# EasyEDA Pro project Twinverter_PB_MTE_3.eprj, board Twinverter_PB_MTE
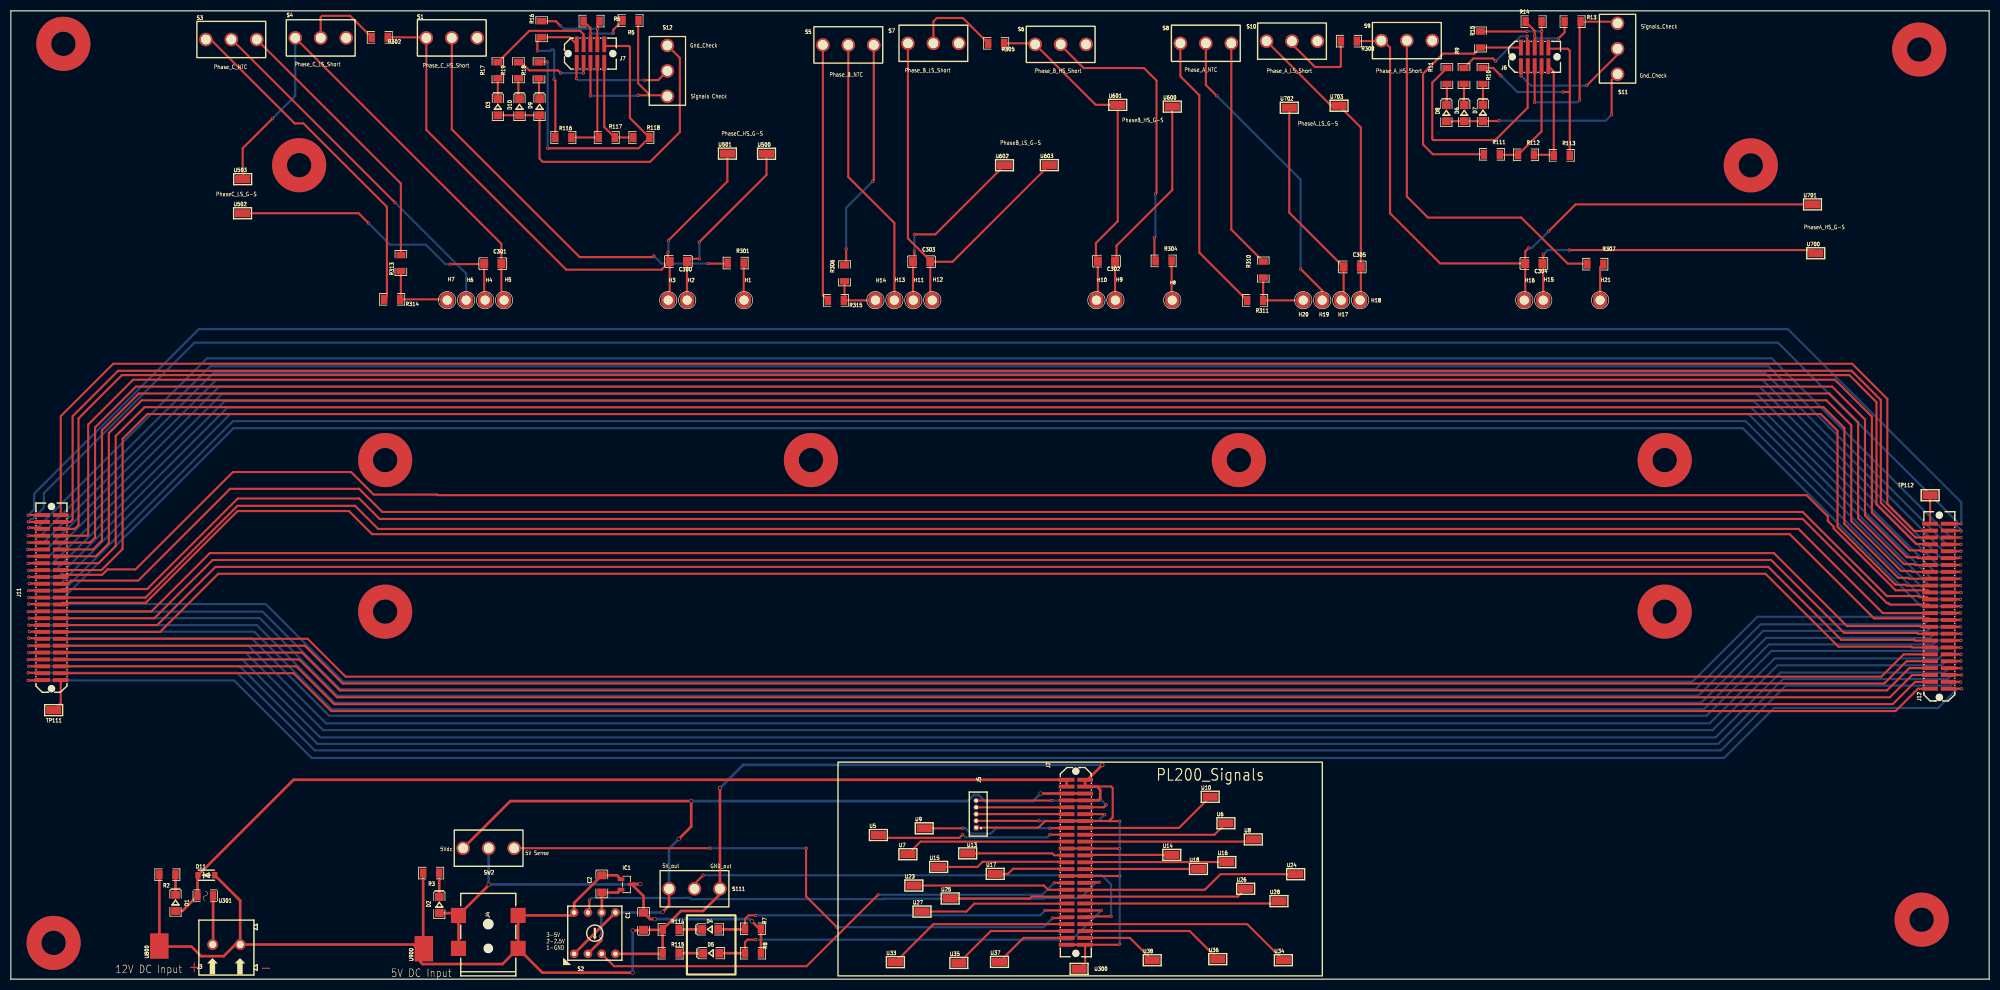
[diagram p4: board, top side]
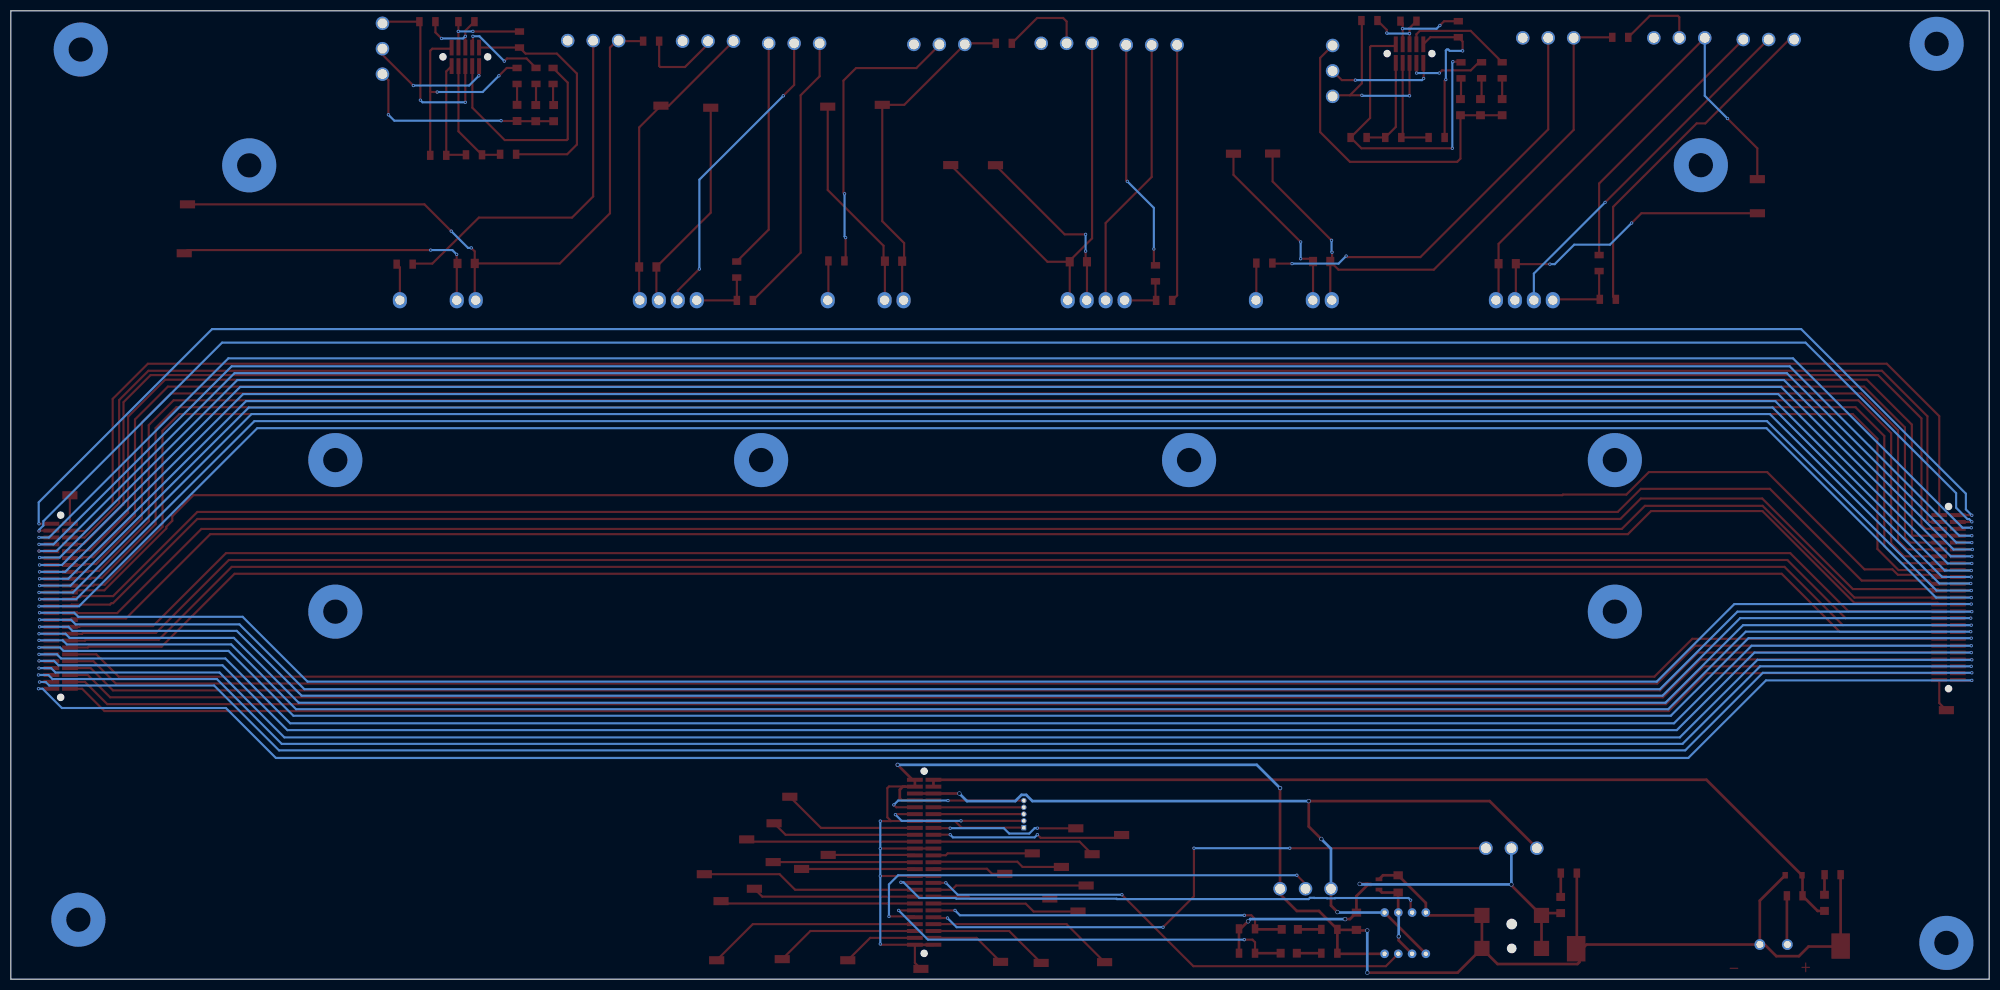
[diagram p5: board, bottom side, seen from below]

Outline 365.2 x 178.9 mm; copper layers: Top Layer, Bottom Layer. Coordinates in mm from the lower left corner of the outline.
Outline path: 0,178.9 365.2,178.9 365.2,0 0,0 0,178.9
Stack: Top Layer 0.0009mm / dielectric 1 0.0384mm FR4 er 4.5 / Bottom Layer 0.0009mm

## Design rules (mm)
template: 用户自定义配置
spacing safeClearance (default): track to track 0.3, other pairs 0 to 0.5
track width trackWidth (default): min 0.127, default 0.254, max 2.54
differential pair differentialPair (default): width min 0.127, default 0.254, max 2.54; gap min 0.152, default 0.152
via viaSize (default): diameter min 0.5, default 0.61, max 10; hole min 0.3, default 0.305, max 6

## Placement (name value [footprint] x y rotation side)
C1  1uF  [C1206]  116.8 10.7 270 top
C2  1uF  [C1206]  109.1 17.6 90 top
C300  100nF  [C1206]  123.22 132.58 180 top
C301  100nF  [C1206]  88.97 132.18 0 top
C302  100nF  [C1206]  202.25 132.65 180 top
C303  100nF  [C1206]  168.13 132.54 0 top
C304  100nF  [C1206]  281.16 132.23 180 top
C305  100nF  [C1206]  247.62 131.58 0 top
D1  XL-3216SURC  [LED1206-R-RD_RED]  30.4 14.1 270 top
D2  XL-3216SURC  [LED1206-R-RD_RED]  79.1 13.7 270 top
D3  XL-3216SURC  [LED1206-R-RD_RED]  89.9 161.1 270 top
D4  XL-3216SURC  [LED1206-R-RD_RED]  129.1 9.2 0 top
D5  XL-3216SURC  [LED1206-R-RD_RED]  129.3 4.8 0 top
D6  XL-3216SURC  [LED1206-R-RD_RED]  268.3 160 270 top
D7  XL-3216SURC  [LED1206-R-RD_RED]  271.75 160.04 270 top
D8  XL-3216SURC  [LED1206-R-RD_RED]  265 160 270 top
D9  XL-3216SURC  [LED1206-R-RD_RED]  97.6 161.1 270 top
D10  XL-3216SURC  [LED1206-R-RD_RED]  93.9 161.1 270 top
D11  PSBD1DF20V3H  [SOD-123F_L2.8-W1.8-LS3.7-RD]  36.1 19.2 0 top
H1  -  [TestPoint:TestPoint_THTPad_D4.0mm_Drill2.0mm]  135.35 125.44 180 top
H2  -  [TestPoint:TestPoint_THTPad_D4.0mm_Drill2.0mm]  124.85 125.44 180 top
H3  -  [TestPoint:TestPoint_THTPad_D4.0mm_Drill2.0mm]  121.35 125.44 180 top
H4  -  [TestPoint:TestPoint_THTPad_D4.0mm_Drill2.0mm]  87.55 125.44 180 top
H5  -  [TestPoint:TestPoint_THTPad_D4.0mm_Drill2.0mm]  91.05 125.44 180 top
H6  -  [TestPoint:TestPoint_THTPad_D4.0mm_Drill2.0mm]  84.05 125.44 180 top
H7  -  [TestPoint:TestPoint_THTPad_D4.0mm_Drill2.0mm]  80.55 125.44 180 top
H8  -  [TestPoint:TestPoint_THTPad_D4.0mm_Drill2.0mm]  214.4 125.44 180 top
H9  -  [TestPoint:TestPoint_THTPad_D4.0mm_Drill2.0mm]  203.9 125.44 180 top
H10  -  [TestPoint:TestPoint_THTPad_D4.0mm_Drill2.0mm]  200.4 125.44 180 top
H11  -  [TestPoint:TestPoint_THTPad_D4.0mm_Drill2.0mm]  166.6 125.44 180 top
H12  -  [TestPoint:TestPoint_THTPad_D4.0mm_Drill2.0mm]  170.1 125.44 180 top
H13  -  [TestPoint:TestPoint_THTPad_D4.0mm_Drill2.0mm]  163.1 125.44 180 top
H14  -  [TestPoint:TestPoint_THTPad_D4.0mm_Drill2.0mm]  159.6 125.44 180 top
H15  -  [TestPoint:TestPoint_THTPad_D4.0mm_Drill2.0mm]  282.88 125.44 180 top
H16  -  [TestPoint:TestPoint_THTPad_D4.0mm_Drill2.0mm]  279.38 125.44 180 top
H17  -  [TestPoint:TestPoint_THTPad_D4.0mm_Drill2.0mm]  245.58 125.44 180 top
H18  -  [TestPoint:TestPoint_THTPad_D4.0mm_Drill2.0mm]  249.08 125.44 180 top
H19  -  [TestPoint:TestPoint_THTPad_D4.0mm_Drill2.0mm]  242.08 125.44 180 top
H20  -  [TestPoint:TestPoint_THTPad_D4.0mm_Drill2.0mm]  238.58 125.44 180 top
H21  -  [TestPoint:TestPoint_THTPad_D4.0mm_Drill2.0mm]  293.38 125.44 180 top
IC1  MCP1700T-2502E/TT(MS)  [SOT-23-3_L2.9-W1.3-P1.90-LS2.4-BR]  113.64 17.5 180 top
J2  TFML-125-02-S-D-A  [CONN-SMD_50P-TFML-125-02-S-D-A]  196.6 21.6 270 top
J3  WJ500V-5.08-2P  [CONN-TH_2P-P5.00_WJ500V-5.08-2P]  39.8 6.4 180 top
J4  DC-005-5A-2.0-SMT  [DC-IN-TH_DC-005-5A-2.0-SMT]  88.14 8.73 90 top
J5  WAFER-MX1.25-5PZZ  [CONN-TH_5P-P1.25_XUNPU_WAFER-MX1.25-5PZZ]  178.2 30.5 90 top
J6  TFML-105-02-S-D-A  [CONN-SMD_TFML-105-02-S-D-A]  281.3 170.4 0 top
J7  TFML-105-02-S-D-A  [CONN-SMD_TFML-105-02-S-D-A]  107 171 0 top
J11  TFML-125-02-S-D-A  [CONN-SMD_50P-TFML-125-02-S-D-A]  7.5 70.5 90 top
J12  TFML-125-02-S-D-A  [CONN-SMD_50P-TFML-125-02-S-D-A]  356 68.9 90 top
R2  1kΩ  [R1206]  28.9 19.3 180 top
R3  300Ω  [R1206]  77.6 19.6 180 top
R5  1kΩ  [R1206]  114.4 177.1 180 top
R6  1kΩ  [R1206]  107.2 177 0 top
R7  10kΩ  [R1206]  137 9.3 0 top
R8  10kΩ  [R1206]  137 4.8 0 top
R9  300Ω  [R1206]  268.25 166.88 270 top
R10  300Ω  [R1206]  271.75 166.86 270 top
R11  300Ω  [R1206]  265.1 166.86 270 top
R13  1kΩ  [R1206]  288.3 176.9 180 top
R14  1kΩ  [R1206]  281.1 176.9 0 top
R15  1kΩ  [R1206]  271.3 173.6 270 top
R16  1kΩ  [R1206]  98 175.5 270 top
R17  300Ω  [R1206]  89.9 167.91 270 top
R18  300Ω  [R1206]  97.5 167.9 270 top
R19  300Ω  [R1206]  93.7 167.91 270 top
R111  1kΩ  [R1206]  273.4 152.4 0 top
R112  1kΩ  [R1206]  279.7 152.3 0 top
R113  1kΩ  [R1206]  286.3 152.2 0 top
R114  10kΩ  [R1206]  121.8 9.2 0 top
R115  10kΩ  [R1206]  121.8 4.8 0 top
R116  1kΩ  [R1206]  102 155.5 0 top
R117  1kΩ  [R1206]  110 155.5 0 top
R118  1kΩ  [R1206]  116.4 155.5 0 top
R301  1kΩ  [R1206]  133.8 132.3 0 top
R302  1kΩ  [R1206]  68.1 174 0 top
R304  1kΩ  [R1206]  212.8 132.7 0 top
R305  1kΩ  [R1206]  181.9 172.9 0 top
R306  5.6kΩ  [R1206]  153.9 130.4 90 top
R307  1kΩ  [R1206]  292.5 132.1 0 top
R308  1kΩ  [R1206]  247 173.3 0 top
R310  5.6kΩ  [R1206]  231.2 131.1 90 top
R311  499Ω  [R1206]  229.7 125.4 180 top
R313  5.1kΩ  [R1206]  72 132.3 90 top
R314  499Ω  [R1206]  70.4 125.6 180 top
R315  499Ω  [R1206]  152.3 125.4 180 top
S1  -  [SW-TH_SS-12D10L5]  81.4 173.9 0 top
S2  SS-10-23NP-E  [SW-TH_8P-L10.0-W10.0-P2.54-S7.6-TR_SS-10-23NP-E]  107.8 8.5 180 top
S3  -  [SW-TH_SS-12D10L5]  40.7 173.6 0 top
S4  -  [SW-TH_SS-12D10L5]  57.2 173.9 0 top
S5  -  [SW-TH_SS-12D10L5]  154.6 172.6 0 top
S6  -  [SW-TH_SS-12D10L5]  193.8 172.7 0 top
S7  -  [SW-TH_SS-12D10L5]  170.3 172.9 0 top
S8  -  [SW-TH_SS-12D10L5]  220.6 172.9 0 top
S9  -  [SW-TH_SS-12D10L5]  257.7 173.4 0 top
S10  -  [SW-TH_SS-12D10L5]  236.5 173.3 0 top
S11  -  [SW-TH_SS-12D10L5]  296.6 171.9 270 top
S12  -  [SW-TH_SS-12D10L5]  121.2 167.8 90 top
S111  SS-12D10L5  [SW-TH_SS-12D10L5]  126.2 16.7 180 top
SW2  SS-12D10L5  [SW-TH_SS-12D10L5]  88.2 24.2 180 top
TP111  RH-5015  [SMD_RH-5015]  7.9 49.7 0 top
TP112  RH-5015  [SMD_RH-5015]  354.3 89.4 0 top
U5  RH-5015  [SMD_RH-5015]  160.15 26.63 0 top
U6  RH-5015  [SMD_RH-5015]  224.3 28.8 0 top
U7  RH-5015  [SMD_RH-5015]  165.6 23.09 0 top
U8  RH-5015  [SMD_RH-5015]  229.36 25.82 0 top
U9  RH-5015  [SMD_RH-5015]  168.61 27.87 0 top
U10  RH-5015  [SMD_RH-5015]  221.4 33.7 0 top
U13  RH-5015  [SMD_RH-5015]  176.64 23.25 0 top
U14  RH-5015  [SMD_RH-5015]  214.32 22.96 0 top
U15  RH-5015  [SMD_RH-5015]  171.27 20.73 0 top
U16  RH-5015  [SMD_RH-5015]  224.47 21.63 0 top
U17  RH-5015  [SMD_RH-5015]  181.71 19.46 0 top
U18  RH-5015  [SMD_RH-5015]  219.23 20.36 0 top
U23  RH-5015  [SMD_RH-5015]  166.7 17.3 0 top
U24  RH-5015  [SMD_RH-5015]  237.18 19.39 0 top
U25  RH-5015  [SMD_RH-5015]  173.4 14.91 0 top
U26  RH-5015  [SMD_RH-5015]  227.94 16.71 0 top
U27  RH-5015  [SMD_RH-5015]  168.2 12.5 0 top
U28  RH-5015  [SMD_RH-5015]  234.1 14.42 0 top
U33  RH-5015  [SMD_RH-5015]  163.29 3.15 0 top
U34  RH-5015  [SMD_RH-5015]  234.9 3.5 0 top
U35  RH-5015  [SMD_RH-5015]  175 3 0 top
U36  RH-5015  [SMD_RH-5015]  222.8 3.7 0 top
U37  RH-5015  [SMD_RH-5015]  182.5 3.2 0 top
U38  RH-5015  [SMD_RH-5015]  210.7 3.5 0 top
U300  RH-5015  [SMD_RH-5015]  197.2 1.9 0 top
U301  TLC-NSMD100/24  [F1206]  35.9 15.4 180 top
U500  RH-5015  [SMD_RH-5015]  139.5 152.5 0 top
U501  RH-5015  [SMD_RH-5015]  132.28 152.53 0 top
U502  RH-5015  [SMD_RH-5015]  42.78 141.5 0 top
U503  RH-5015  [SMD_RH-5015]  42.8 147.8 0 top
U600  RH-5015  [SMD_RH-5015]  214.4 161.2 0 top
U601  RH-5015  [SMD_RH-5015]  204.33 161.53 0 top
U602  RH-5015  [SMD_RH-5015]  183.43 150.38 0 top
U603  RH-5015  [SMD_RH-5015]  191.7 150.4 0 top
U700  RH-5015  [SMD_RH-5015]  333.19 134.12 0 top
U701  RH-5015  [SMD_RH-5015]  332.59 143.15 0 top
U702  RH-5015  [SMD_RH-5015]  236 161 0 top
U703  RH-5015  [SMD_RH-5015]  245.19 161.38 0 top
U800  5016  [TEST-SMD_L4.7-P3.4]  27.42 6.12 90 top
U900  5016  [TEST-SMD_L4.7-P3.4]  76.23 5.62 90 top

## Footprints (pads in the part's own frame, mm; a bottom-side part is the same pattern mirrored in y, then rotated)
C1206
  rect 1.485x1.728 smd: 1(-1.593,0) 2(1.593,0)
CONN-SMD_50P-TFML-125-02-S-D-A
  rect 0.74x2.92 smd: 01(-15.24,-1.715) 02(-15.24,1.715) 03(-13.97,-1.715) 04(-13.97,1.715) 05(-12.7,-1.715) 06(-12.7,1.715) 07(-11.43,-1.715) 08(-11.43,1.715) 09(-10.16,-1.715) 10(-10.16,1.715) 11(-8.89,-1.715) 12(-8.89,1.715) 13(-7.62,-1.715) 14(-7.62,1.715) 15(-6.35,-1.715) 16(-6.35,1.715) 17(-5.08,-1.715) 18(-5.08,1.715) 19(-3.81,-1.715) 20(-3.81,1.715) 21(-2.54,-1.715) 22(-2.54,1.715) 23(-1.27,-1.715) 24(-1.27,1.715) 25(0,-1.715) 26(0,1.715) 27(1.27,-1.715) 28(1.27,1.715) 29(2.54,-1.715) 30(2.54,1.715) 31(3.81,-1.715) 32(3.81,1.715) 33(5.08,-1.715) 34(5.08,1.715) 35(6.35,-1.715) 36(6.35,1.715) 37(7.62,-1.715) 38(7.62,1.715) 39(8.89,-1.715) 40(8.89,1.715) 41(10.16,-1.715) 42(10.16,1.715) 43(11.43,-1.715) 44(11.43,1.715) 45(12.7,-1.715) 46(12.7,1.715) 47(13.97,-1.715) 48(13.97,1.715) 49(15.24,-1.715) 50(15.24,1.715)
CONN-SMD_TFML-105-02-S-D-A
  rect 0.74x2.92 smd: 1(-2.54,-1.715) 2(-2.54,1.715) 3(-1.27,-1.715) 4(-1.27,1.715) 5(0,-1.715) 6(0,1.715) 7(1.27,-1.715) 8(1.27,1.715) 9(2.54,-1.715) 10(2.54,1.715)
CONN-TH_2P-P5.00_WJ500V-5.08-2P
  round 2 hole 1.3: 1(-2.54,0) 2(2.54,0)
CONN-TH_5P-P1.25_XUNPU_WAFER-MX1.25-5PZZ
  rect 1x0.9 hole 0.65: 1(-2.5,0)
  round 1 hole 0.65: 2(-1.25,0) 3(-0.001,0) 4(1.25,0) 5(2.5,0)
DC-IN-TH_DC-005-5A-2.0-SMT
  rect 2.8x2.8 smd: 1(-3.05,5.5) 1(3.05,5.5) 2(-3.05,-5.5) 3(3.05,-5.5)
F1206
  rect 1.19x1.728 smd: 1(-1.445,0) 2(1.445,0)
LED1206-R-RD_RED
  rect 1.485x1.62 smd: 1(1.492,0) 2(-1.492,0)
R1206
  rect 1.208x1.701 smd: 1(-1.479,0) 2(1.479,0)
SMD_RH-5015
  rect 2.8x1.5 smd: 1(0,0)
SOD-123F_L2.8-W1.8-LS3.7-RD
  rect 1x1.2 smd: 1(-1.55,0) 2(1.55,0)
SOT-23-3_L2.9-W1.3-P1.90-LS2.4-BR
  rect 1.25x0.7 smd: 1(1,-0.95) 2(1,0.95) 3(-1,0)
SW-TH_8P-L10.0-W10.0-P2.54-S7.6-TR_SS-10-23NP-E
  round 1.6 hole 0.8: 1(3.81,-3.81) 2(-1.27,-3.81) 3(-3.81,-3.81) 11(-3.81,3.81) 12(1.27,3.81) 13(3.81,3.81) C(1.27,-3.81) C1(-1.27,3.81)
SW-TH_SS-12D10L5
  round 2.499 hole 1.801: 1(-4.699,0) 2(0,0) 3(4.699,0)
TEST-SMD_L4.7-P3.4
  rect 4.699x3.429 smd: 1(0,0)
TestPoint:TestPoint_THTPad_D4.0mm_Drill2.0mm
  oval 2.6x3 hole 1.7: 1(0,0)

## Nets
+2.5V: C2.1 IC1.2 S2.2 S2.12
$1I1\$1N11: R311.2 S8.1
$1I1\$1N19: R314.2 S3.1
$1I1\$1N41: R315.2 S5.1
$1I1\$1N11343: R306.2 S5.3
$1I1\$1N11438: R304.1 S6.2
$1I1\$1N11475: R305.1 S7.2
$1I1\$1N11625: R301.1 S1.2
$1I1\$1N11639: R302.1 S4.2
$1I1\$1N11730: R313.2 S3.3
$1I1\$1N12052: R310.2 S8.3
$1I1\$1N12111: R307.1 S9.2
$1I1\$1N12143: R308.1 S10.2
$1I1\HS_D_PHASEA: H21.1 R307.2
$1I1\HS_D_PHASEB: H8.1 R304.2
$1I1\HS_D_PHASEC: H1.1 R301.2
$1I1\HS_G_PHASEA: C304.1 H15.1 U700.1
$1I1\HS_G_PHASEB: C302.1 H9.1 U600.1
$1I1\HS_G_PHASEC: C300.1 H2.1 U500.1
$1I1\HS_S_PHASEA: C304.2 H16.1 R308.2 S9.1 U701.1
$1I1\HS_S_PHASEB: C302.2 H10.1 R305.2 S6.1 U601.1
$1I1\HS_S_PHASEC: C300.2 H3.1 R302.2 S1.1 U501.1
$1I1\LS_G_PHASEA: C305.1 H17.1 U702.1
$1I1\LS_G_PHASEB: C303.1 H11.1 U602.1
$1I1\LS_G_PHASEC: C301.1 H4.1 U502.1
$1I1\LS_S_PHASEA: C305.2 H18.1 S10.1 U703.1
$1I1\LS_S_PHASEB: C303.2 H12.1 S7.1 U603.1
$1I1\LS_S_PHASEC: C301.2 H5.1 S4.1 U503.1
$1I1\NTC_1_PHASEA: H19.1 S8.2
$1I1\NTC_1_PHASEB: H13.1 S5.2
$1I1\NTC_1_PHASEC: H6.1 S3.2
$1I1\NTC_2_PHASEA: H20.1 R310.1 R311.1
$1I1\NTC_2_PHASEB: H14.1 R306.1 R315.1
$1I1\NTC_2_PHASEC: H7.1 R313.1 R314.1
$1I7\$1N5: J7.7 R116.2 R117.1
$1I7\$1N8: J6.7 R111.2 R112.1
$1I7\$1N9: J7.4 R17.1
$1I7\$1N15: J7.3 R19.1
$1I7\$1N18: J7.6 R5.2 R6.1
$1I7\$1N20: J7.2 R16.2 R116.1
$1I7\$1N23: J6.5 R13.1 S11.1
$1I7\$1N24: J7.9 R117.2 R118.1
$1I7\$1N26: D10.2 R19.2
$1I7\$1N30: J6.3 R11.1
$1I7\$1N31: D6.2 R9.2
$1I7\$1N37: J6.1 S11.2
$1I7\$1N39: J7.1 S12.2
$1I7\$1N40: D9.2 R18.2
$1I7\$1N1207: J6.4 R9.1
$1I7\$1N1231: J6.6 R13.2 R14.1
$1I7\$1N1256: J6.8 R14.2 R15.1
$1I7\$1N1264: J6.2 R15.2 R111.1
$1I7\$1N1531: D3.2 R17.2
$1I7\$1N1570: D7.2 R10.2
$1I7\$1N1737: D8.2 R11.2
$1I7\$1N1750: D6.1 D7.1 D8.1 S11.3
$1I7\$1N9618: D3.1 D9.1 D10.1 S12.3
$1I7\$1N9623: J7.5 R5.1 S12.1
$1I7\$1N10247: J6.10 R10.1 R113.2
$1I7\$1N10253: J6.9 R112.2 R113.1
$1I7\$1N11124: J7.10 R18.1 R118.2
$1I7\$1N11180: J7.8 R6.2 R16.1
$1I13\$1N1: J11.33 J12.32
$1I13\$1N2: J11.29 J12.28
$1I13\$1N3: J11.28 J12.27
$1I13\$1N4: J11.11 J12.10
$1I13\$1N5: J11.15 J12.14
$1I13\$1N6: J11.36 J12.35
$1I13\$1N7: J11.12 J12.11
$1I13\$1N8: J11.19 J12.18
$1I13\$1N9: J11.14 J12.13
$1I13\$1N10: J11.25 J12.24
$1I13\$1N12: J11.31 J12.30
$1I13\$1N13: J11.03 J12.02
$1I13\$1N14: J11.13 J12.12
$1I13\$1N15: J11.41 J12.40
$1I13\$1N16: J11.35 J12.34
$1I13\$1N17: J11.38 J12.37
$1I13\$1N18: J11.45 J12.44
$1I13\$1N19: J11.39 J12.38
$1I13\$1N21: J11.37 J12.36
$1I13\$1N22: J11.21 J12.20
$1I13\$1N23: J11.43 J12.42
$1I13\$1N24: J11.17 J12.16
$1I13\$1N26: J11.23 J12.22
$1I13\$1N29: J11.47 J12.46
$1I13\$1N30: J11.07 J12.06
$1I13\$1N31: J12.50 TP112.1
$1I13\$1N33: J11.09 J12.08
$1I13\$1N34: J11.49 J12.48
$1I13\$1N35: J11.44 J12.43
$1I13\$1N36: J11.40 J12.39
$1I13\$1N37: J11.27 J12.26
$1I13\$1N41: J11.22 J12.21
$1I13\$1N43: J11.05 J12.04
$1I13\$1N44: J11.02 J12.01
$1I13\$1N51: J11.26 J12.25
$1I13\$1N52: J11.16 J12.15
$1I13\$1N57: J11.50 J12.49
$1I13\$1N58: J11.10 J12.09
$1I13\$1N59: J11.01 TP111.1
$1I13\$1N60: J11.20 J12.19
$1I13\$1N61: J11.24 J12.23
$1I13\$1N62: J11.06 J12.05
$1I13\$1N63: J11.04 J12.03
$1I13\$1N64: J11.18 J12.17
$1I13\$1N65: J11.42 J12.41
$1I13\$1N66: J11.30 J12.29
$1I13\$1N68: J11.08 J12.07
$1I13\$1N69: J11.48 J12.47
$1I13\$1N71: J11.32 J12.31
$1I13\$1N72: J11.46 J12.45
$1I13\$1N73: J11.34 J12.33
$1I19\5V_SENSE: J2.41 SW2.1
$1I19\$1N61: D4.2 R114.2
$1I19\$1N77: D2.2 R3.1
$1I19\$1N81: D1.2 R2.1
$1I19\$1N108: J2.05 J2.06 S2.3 S2.13 S111.3 SW2.3
$1I19\$1N109: D5.2 R115.2
$1I19\$1N17982: J2.42 S111.2
$1I19\$1N26702: J3.2 U301.1
$1I19\AOUT_AH: J2.33 U23.1
$1I19\AOUT_AL: J2.34 U24.1
$1I19\AOUT_BH: J2.35 U25.1
$1I19\AOUT_BL: J2.36 U26.1
$1I19\AOUT_CH: J2.37 U27.1
$1I19\AOUT_CL: J2.38 U28.1
$1I19\BUF_PWM_AH: J2.16 U10.1
$1I19\BUF_PWM_AL: J2.15 U9.1
$1I19\BUF_PWM_BH: J2.18 U6.1
$1I19\BUF_PWM_BL: J2.17 U5.1
$1I19\BUF_PWM_CH: J2.20 U8.1
$1I19\BUF_PWM_CL: J2.19 U7.1
$1I19\GD_GS_OFF: J2.32 S2.C
$1I19\GD_GS_ON: J2.31 S2.C1
$1I19\GD_INTB_H: D4.1 J2.39 R7.1
$1I19\GD_INTB_L: D5.1 J2.40 R8.1
$1I19\INTA_AH: J2.24 U14.1
$1I19\INTA_AL: J2.23 U13.1
$1I19\INTA_BH: J2.26 U16.1
$1I19\INTA_BL: J2.25 U15.1
$1I19\INTA_CH: J2.28 U18.1
$1I19\INTA_CL: J2.27 U17.1
$1I19\PHASE_A_HI_RANGE: J2.43 U33.1
$1I19\PHASE_A_LO_RANGE: J2.44 U34.1
$1I19\PHASE_B_HI_RANGE: J2.45 U35.1
$1I19\PHASE_B_LO_RANGE: J2.46 U36.1
$1I19\PHASE_C_HI_RANGE: J2.47 U37.1
$1I19\PHASE_C_LO_RANGE: J2.48 U38.1
$1I19\SPI_CLK: J2.12 J5.2
$1I19\SPI_CS: J2.10 J5.5
$1I19\SPI_MISO: J2.11 J5.3
$1I19\SPI_MOSI: J2.09 J5.4
POWER_+5VD: C1.1 D2.1 IC1.3 J4.1 R7.2 R8.2 SW2.2
POWER_+12V: D1.1 D11.1 J2.01 J2.03 U301.2
POWER_GND: C1.2 C2.2 D11.2 IC1.1 J2.02 J2.04 J2.07 J2.08 J2.13 J2.14 J2.21 J2.22 J2.29 J2.30 J2.49 J2.50 J3.1 J4.2 J4.3 J5.1 R2.2 R3.2 R114.1 R115.1 S2.1 S2.11 S111.1 U300.1 U800.1 U900.1

Pads without a net: S1 3; S4 3; S6 3; S7 3; S9 3; S10 3

## Via types
v1: diameter 10, hole 4.5, Top Layer to Bottom Layer, 12 vias
v2: diameter 0.8, hole 0.6, Top Layer to Bottom Layer, 10 vias
v3: diameter 0.61, hole 0.305, Top Layer to Bottom Layer, 126 vias
v4: diameter 0.8, hole 0.5, Top Layer to Bottom Layer, 3 vias

## Routing (per net, layer and track width the routed paths; a pad name or vN(x,y) marks a point on that pad's centre or on a via; arc(x,y) is an arc through that point)
+2.5V: length 16.2
  Top Layer w0.5: S2.12 109,7.16 v4(109,7.9) ; S2.2 109.1,12.34 C2.1 112.1,16.01 IC1.2
  Bottom Layer w0.5: v4(109,7.9) 109,12.24 S2.2
(no net):
  vias: v1(7.9,6.7) v1(9.7,172.8) v1(53.23,150.38) v1(69.1,95.9) v1(69.1,67.9) v1(147.7,95.9) v1(226.7,95.9) v1(305.3,95.9) v1(305.3,67.9) v1(321.2,150.35) v1(352.3,171.75) v1(352.73,10.99)
$1I1\$1N11: length 52.6
  Top Layer w0.4: S8.1 215.9,166.8 219.4,163.3 219.4,134.22 228.22,125.4
$1I1\$1N19: length 63.5
  Top Layer w0.4: 68.92,125.6 69.42,126.1 69.42,142.68 54,158.1 52.4,158.1 36.9,173.6 S3.1
$1I1\$1N41: length 47.6
  Top Layer w0.4: S5.1 149.9,126.32 150.82,125.4
$1I1\$1N11343: length 43
  Top Layer w0.4: v3(159.1,147.4) 159.3,147.6 S5.3 ; 153.9,131.88 154.2,132.18 v3(154.2,134.9)
  Bottom Layer w0.4: v3(154.2,134.9) 154.2,142.5 v3(159.1,147.4)
$1I1\$1N11438: length 54.1
  Top Layer w0.4: v3(211.1,137) 211.1,132.92 211.32,132.7 ; S6.2 193.8,172.57 198.05,168.32 209.18,168.32 211.5,166 211.5,145.3 v3(211.3,145.1)
  Bottom Layer w0.4: v3(211.3,145.1) 211.3,137.2 v3(211.1,137)
$1I1\$1N11475: length 16.4
  Top Layer w0.4: 180.42,172.9 175.74,177.58 170.95,177.58 170.3,176.93 S7.2
$1I1\$1N11625: length 78.3
  Top Layer w0.4: 132.32,132.3 132.22,132.2 v3(128.7,132.2) ; S1.2 81.4,157 105,133.4 118.5,133.4 v3(118.7,133.6)
  Bottom Layer w0.4: v3(128.7,132.2) 120.1,132.2 v3(118.7,133.6)
$1I1\$1N11639: length 15
  Top Layer w0.4: S4.2 57.2,177.72 57.45,177.98 62.64,177.98 66.62,174
$1I1\$1N11730: length 50.8
  Top Layer w0.4: 72,133.78 72,147 S3.3
$1I1\$1N12052: length 42.8
  Top Layer w0.4: S8.3 225.3,138.48 231.2,132.58
$1I1\$1N12111: length 67.3
  Top Layer w0.4: 291.02,132.1 290.92,132.2 287.4,132.2 278.8,140.7 261.6,140.7 257.7,144.6 S9.2
$1I1\$1N12143: length 16
  Top Layer w0.4: 245.52,173.3 245.52,168.72 245.32,168.52 240.75,168.52 236.5,172.77 S10.2
$1I1\HS_D_PHASEA: length 6.9
  Top Layer w0.4: 293.98,132.1 293.38,131.5 H21.1
$1I1\HS_D_PHASEB: length 7.3
  Top Layer w0.4: R304.2 214.28,125.56 H8.1
$1I1\HS_D_PHASEC: length 6.9
  Top Layer w0.4: R301.2 135.28,125.51 H1.1
$1I1\HS_G_PHASEA: length 59.4
  Top Layer w0.4: v3(282.9,133.9) 282.9,132.38 C304.1 282.88,132.1 H15.1 ; U700.1 332.61,134.7 v3(287.7,134.7)
  Bottom Layer w0.4: v3(287.7,134.7) 283.7,134.7 v3(282.9,133.9)
$1I1\HS_G_PHASEB: length 40.2
  Top Layer w0.4: H9.1 203.85,125.49 C302.1 204.1,132.9 204.1,135.5 214.4,145.8 U600.1
$1I1\HS_G_PHASEC: length 34.2
  Top Layer w0.4: H2.1 124.81,125.48 C300.1 125.33,133.1 v3(127.1,133.1) ; v3(127.1,136.2) 139.5,148.6 U500.1
  Bottom Layer w0.4: v3(127.1,136.2) v3(127.1,133.1)
$1I1\HS_S_PHASEA: length 131.8
  Top Layer w0.4: C304.2 279.56,134.46 v3(280.2,135.1) ; C304.2 263.86,132.23 254.6,141.49 254.6,172.1 253.3,173.4 S9.1 252.9,173.3 R308.2 ; C304.2 279.56,125.62 H16.1 ; U701.1 288.85,143.15 v3(283.9,138.2)
  Bottom Layer w0.4: v3(280.2,135.1) 280.8,135.1 v3(283.9,138.2)
$1I1\HS_S_PHASEB: length 63.7
  Top Layer w0.4: H10.1 200.66,125.7 C302.2 200.3,133.01 200.3,136 204.33,140.03 U601.1 200.27,161.53 S6.1 188.9,172.9 R305.2
$1I1\HS_S_PHASEC: length 112.3
  Top Layer w0.4: R302.2 76.6,174 S1.1 76.7,156.9 102.52,131.08 120.13,131.08 C300.2 ; H3.1 121.63,125.72 C300.2 ; v3(121.3,134.3) 121.3,132.91 C300.2 ; U501.1 132.28,147.38 v3(121.4,136.5)
  Bottom Layer w0.4: v3(121.4,136.5) 121.4,134.4 v3(121.3,134.3)
$1I1\LS_G_PHASEA: length 39.9
  Top Layer w0.4: H17.1 246.03,125.89 C305.1 236,141.61 U702.1
$1I1\LS_G_PHASEB: length 34.2
  Top Layer w0.4: U602.1 170.66,137.6 v3(166.8,137.6) ; H11.1 166.54,125.5 C303.1 166.8,132.8 v3(166.8,134.5)
  Bottom Layer w0.4: v3(166.8,137.6) v3(166.8,134.5)
$1I1\LS_G_PHASEC: length 55.3
  Top Layer w0.4: v3(81.1,132.1) 87.3,132.1 C301.1 87.38,125.61 H4.1 ; v3(66,139.7) 64.19,141.5 U502.1
  Bottom Layer w0.4: v3(66,139.7) 70,135.7 76.6,135.7 80.2,132.1 v3(81.1,132.1)
$1I1\LS_S_PHASEA: length 56
  Top Layer w0.4: H18.1 249.21,125.57 C305.2 249.21,157.35 U703.1 243.72,161.38 S10.1
$1I1\LS_S_PHASEB: length 78.7
  Top Layer w0.4: C303.2 169.73,125.81 H12.1 ; C303.2 173.84,132.54 U603.1 ; C303.2 169.73,132.74 165.6,136.86 S7.1
$1I1\LS_S_PHASEC: length 94.5
  Top Layer w0.4: U503.1 42.8,153.5 v3(48.3,159) ; 52.5,173.9 90.56,135.84 C301.2 90.56,125.93 H5.1
  Bottom Layer w0.4: v3(48.3,159) 52.5,163.2 52.5,173.9
$1I1\NTC_1_PHASEA: length 56.4
  Top Layer w0.4: v3(238.1,131.2) 242.08,127.22 H19.1 ; S8.2 220.6,165.2 v3(222.6,163.2)
  Bottom Layer w0.4: v3(222.6,163.2) 238.1,147.7 v3(238.1,131.2)
$1I1\NTC_1_PHASEB: length 50.7
  Top Layer w0.4: S5.2 154.6,148.2 163.1,139.7 H13.1
$1I1\NTC_1_PHASEC: length 66.2
  Top Layer w0.4: S3.2 40.8,173.6 v3(70.9,143.5)
  Bottom Layer w0.4: H6.1 84.05,130.35 v3(70.9,143.5)
$1I1\NTC_2_PHASEA: length 11.6
  Top Layer w0.4: R310.1 231.18,129.6 R311.1 238.54,125.4 H20.1
$1I1\NTC_2_PHASEB: length 9.4
  Top Layer w0.4: R306.1 153.9,125.52 R315.1 159.56,125.4 H14.1
$1I1\NTC_2_PHASEC: length 14
  Top Layer w0.4: R313.1 72,125.72 R314.1 80.39,125.6 H7.1
$1I7\$1N5: length 18.9
  Top Layer w0.4: R116.2 108.52,155.5 108.27,155.75 J7.7
$1I7\$1N8: length 21.6
  Top Layer w0.4: R111.2 274.98,152.3 278.22,152.3 282.57,156.65 J6.7
$1I7\$1N9: length 20.4
  Top Layer w0.4: R17.1 95.71,175.2 105.1,175.2 105.73,174.57 J7.4
$1I7\$1N15: length 14.7
  Top Layer w0.4: R19.1 94.2,169.39 95.69,167.9 101,167.9 v3(101.5,167.4) ; J7.3 105.7,169.25 v3(105.7,167.4)
  Bottom Layer w0.4: v3(101.5,167.4) v3(105.7,167.4)
$1I7\$1N18: length 12.1
  Top Layer w0.4: 105.72,177 107,175.72 v3(107,174.7) J7.6 ; v3(111.2,174.8) 111.2,175.38 112.92,177.1
  Bottom Layer w0.4: v3(111.2,174.8) 111.1,174.7 v3(107,174.7)
$1I7\$1N20: length 29.3
  Top Layer w0.4: J7.2 103.15,174.02 R16.2 97.2,173.22 v3(97.2,171.5) ; v3(100.3,166.2) 100.52,165.98 100.52,155.5
  Bottom Layer w0.4: v3(97.2,171.5) 99.59,171.5 99.84,171.75 100.12,171.75 100.3,171.57 v3(100.3,166.2)
$1I7\$1N23: length 36.7
  Top Layer w0.4: 296.6,176.6 296.3,176.9 R13.1 289.6,176.72 v3(289.6,162.4) ; J6.5 v3(281.3,162)
  Bottom Layer w0.4: v3(289.6,162.4) 289.2,162 v3(281.3,162)
$1I7\$1N24: length 18
  Top Layer w0.4: 114.92,155.5 R117.2 109.54,157.44 J7.9
$1I7\$1N26: length 3.9
  Top Layer w0.4: R19.2 93.7,162.79 D10.2
$1I7\$1N30: length 42.1
  Top Layer w0.4: J6.3 280,168.66 280,161 274.02,155.02 262.58,155.02 262.4,155.2 262.4,165.64 R11.1
$1I7\$1N31: length 3.9
  Top Layer w0.4: D6.2 268.25,161.54 R9.2
$1I7\$1N37: length 23.8
  Top Layer w0.4: J6.1 278.76,166.94 v3(278.8,166.9) ; v3(290.9,165.1) 296.6,170.8 S11.2
  Bottom Layer w0.4: v3(290.9,165.1) 280.6,165.1 v3(278.8,166.9)
$1I7\$1N39: length 20.5
  Top Layer w0.4: v3(104.4,166.4) 104.4,169.22 J7.1 ; S12.2 119.5,166.1 v3(117,166.1)
  Bottom Layer w0.4: v3(104.4,166.4) 104.7,166.1 v3(117,166.1)
$1I7\$1N40: length 3.9
  Top Layer w0.4: D9.2 97.5,162.69 R18.2
$1I7\$1N1207: length 16.6
  Top Layer w0.4: v3(279.9,174.2) 279.9,172.25 J6.4 ; v3(274.1,169.6) 273.6,170.1 270,170.1 R9.1
  Bottom Layer w0.4: v3(279.9,174.2) 278.7,174.2 v3(274.1,169.6)
$1I7\$1N1231: length 13.6
  Top Layer w0.4: 279.62,176.9 281.3,175.22 v3(281.3,174.2) J6.6 ; 286.82,176.9 286.82,174.92 v3(285.7,173.8)
  Bottom Layer w0.4: v3(285.7,173.8) 281.7,173.8 v3(281.3,174.2)
$1I7\$1N1256: length 16.1
  Top Layer w0.4: R14.2 282.58,175.12 ; 282.58,175.12 v3(282.6,175.1) ; 282.58,175.12 282.58,172.12 J6.8 ; R15.1 279.88,175.08 v3(279.9,175.1)
  Bottom Layer w0.4: v3(279.9,175.1) v3(282.6,175.1)
$1I7\$1N1264: length 45.1
  Top Layer w0.4: J6.2 278.75,172.12 271.3,172.12 270.18,171 264.4,171 260.7,167.3 260.7,154.2 262.5,152.4 271.92,152.4
$1I7\$1N1531: length 3.8
  Top Layer w0.4: R17.2 D3.2
$1I7\$1N1570: length 3.9
  Top Layer w0.4: R10.2 D7.2
$1I7\$1N1737: length 3.9
  Top Layer w0.4: R11.2 265.1,161.59 D8.2
$1I7\$1N1750: length 39
  Top Layer w0.4: D8.1 D6.1 271.71,158.51 D7.1 274.64,158.55 v3(274.7,158.6) ; v3(295.5,159.7) 295.5,166.1 S11.3
  Bottom Layer w0.4: v3(274.7,158.6) 294.4,158.6 v3(295.5,159.7)
$1I7\$1N9618: length 61.1
  Top Layer w0.4: D3.1 D10.1 D9.1 97.6,151.6 98.2,151 118,151 123.5,156.5 123.5,170.2 S12.3
$1I7\$1N9623: length 35.2
  Top Layer w0.4: R5.1 115.8,177.02 115.8,165.5 118,163.3 121,163.3 S12.1 ; v3(115.8,163.3) 118,163.3 ; J7.5 v3(107,163.2)
  Bottom Layer w0.4: v3(115.8,163.3) 115.7,163.2 v3(107,163.2)
$1I7\$1N10247: length 41.4
  Top Layer w0.4: J6.10 284.06,171.9 287.4,171.9 287.78,171.52 287.78,163.99 ; 287.78,163.99 287.69,163.9 v3(286.5,163.9) ; 287.78,163.99 R113.2 ; v3(275.1,166.9) 273.66,168.34 R10.1
  Bottom Layer w0.4: v3(275.1,166.9) 278.1,163.9 v3(286.5,163.9)
$1I7\$1N10253: length 20.6
  Top Layer w0.4: J6.9 284.82,167.7 284.82,152.2 284.72,152.3 R112.2
$1I7\$1N11124: length 60.4
  Top Layer w0.4: v3(99,169.5) 97.62,169.5 97.5,169.38 ; v3(99.1,153.5) 115.88,153.5 R118.2 114.28,159.1 114.28,172.22 114.1,172.4 109.85,172.4 J7.10
  Bottom Layer w0.4: v3(99,169.5) 99.1,169.4 v3(99.1,153.5)
$1I7\$1N11180: length 15.4
  Top Layer w0.4: 108.27,175.6 108.27,176.59 R6.2 ; 108.27,175.6 v3(108.3,175.6) ; 108.27,175.6 J7.8 ; v3(101.4,176.2) 100.62,176.98 R16.1
  Bottom Layer w0.4: v3(101.4,176.2) 102,175.6 v3(108.3,175.6)
$1I13\$1N1: length 392.4
  Top Layer w0.4: J11.33 16.73,75.58 20.63,79.48 20.63,99.83 25.2,104.4 334.1,104.4 337.2,101.3 337.2,83.57 347.9,72.88 349.78,72.88 349.94,72.71 J12.32
$1I13\$1N2: length 360.8
  Top Layer w0.4: J12.28 354.09,70.17 353.69,70.57 352.42,70.57 352.22,70.77 346.32,70.77 330.77,86.32 68.57,86.32 64.3,90.59 40.48,90.59 23.53,73.64 11.08,73.64 10.48,73.04 J11.29
$1I13\$1N3: length 387.9
  Top Layer w0.4: v3(359.9,70.2) 359.87,70.17 357.72,70.17 ; v3(3.3,71.8) 5.76,71.8 J11.28
  Bottom Layer w0.4: v3(3.3,71.8) 9.72,71.8 41.02,103.1 320.24,103.1 353.14,70.2 v3(359.9,70.2)
$1I13\$1N4: length 349.7
  Top Layer w0.4: J11.11 54.27,61.61 61.26,54.62 345.82,54.62 349.94,58.74 J12.10
$1I13\$1N5: length 355.2
  Top Layer w0.4: J11.15 27.55,64.15 38.3,74.9 323.9,74.9 337.37,61.43 350.84,61.43 350.99,61.28 J12.14
$1I13\$1N6: length 388.1
  Top Layer w0.4: 357.72,75.25 v3(359.9,75.25) ; J11.36 3.25,76.85 v3(3.2,76.8)
  Bottom Layer w0.4: v3(359.9,75.25) 355.16,75.25 322.31,108.1 38.95,108.1 7.65,76.8 v3(3.2,76.8)
$1I13\$1N7: length 372.7
  Top Layer w0.4: J11.12 3.31,61.61 v3(3.3,61.6) ; 357.72,60.01 v3(360,60.01)
  Bottom Layer w0.4: v3(360,60.01) 356.69,60.01 355.93,59.25 325.6,59.25 313.62,47.27 58.18,47.27 43.85,61.6 v3(3.3,61.6)
$1I13\$1N8: length 355.2
  Top Layer w0.4: J12.18 352.05,63.82 351.89,63.97 338.42,63.97 324.95,77.44 37.25,77.44 26.5,66.69 J11.19
$1I13\$1N9: length 372.7
  Top Layer w0.4: J11.14 5.67,63 v3(3.3,63) ; 357.72,61.28 v3(360,61.28)
  Bottom Layer w0.4: v3(3.3,63) 44.43,63 58.76,48.67 313.04,48.67 325.02,60.65 355.48,60.65 356.11,61.28 v3(360,61.28)
$1I13\$1N10: length 360.3
  Top Layer w0.4: J12.24 345.57,67.63 330.01,83.18 67.81,83.18 63.55,87.45 41.83,87.45 24.88,70.5 J11.25
$1I13\$1N12: length 363
  Top Layer w0.4: J12.30 353.89,71.84 347.94,71.84 336.5,83.28 336.5,83.58 335.4,84.68 335.4,85.52 331.5,89.42 78.8,89.42 78.69,89.53 66.97,89.53 62.81,93.69 40.98,93.69 23.01,75.71 17.85,75.71 16.85,74.71 9.62,74.71 J11.31
$1I13\$1N13: length 349.7
  Top Layer w0.4: J12.02 352.05,53.66 347.92,49.54 59.16,49.54 52.17,56.53 J11.03
$1I13\$1N14: length 349.7
  Top Layer w0.4: J11.13 54.8,62.88 61.79,55.89 345.29,55.89 349.42,60.01 J12.12
$1I13\$1N15: length 392.4
  Top Layer w0.4: J11.41 14.63,80.66 15.55,81.58 15.55,101.93 23.1,109.48 336.2,109.48 342.28,103.4 342.28,85.67 350,77.95 351.88,77.95 352.05,77.79 J12.40
$1I13\$1N16: length 392.4
  Top Layer w0.4: J12.34 350.47,73.98 350.3,74.14 348.42,74.14 338.47,84.1 338.47,101.83 334.63,105.67 24.67,105.67 19.36,100.36 19.36,80.01 16.2,76.85 J11.35
$1I13\$1N17: length 388.1
  Top Layer w0.4: J11.38 v3(3.2,78.12) ; 357.72,76.52 v3(359.9,76.52)
  Bottom Layer w0.4: v3(359.9,76.52) 355.76,76.52 322.86,109.42 38.4,109.42 7.1,78.12 v3(3.2,78.12)
$1I13\$1N18: length 392.4
  Top Layer w0.4: J12.44 354.22,80.4 351.7,80.4 344.4,87.7 344.4,106.6 339.4,111.6 20.5,111.6 12.5,103.6 12.5,83.9 11.8,83.2 J11.45
$1I13\$1N19: length 392.4
  Top Layer w0.4: J11.39 15.15,79.39 16.82,81.06 16.82,101.41 23.62,108.21 335.68,108.21 341.01,102.88 341.01,85.15 349.47,76.69 351.35,76.69 351.52,76.52 J12.38
$1I13\$1N21: length 392.4
  Top Layer w0.4: J12.36 350.99,75.25 350.83,75.42 348.95,75.42 339.74,84.62 339.74,102.35 335.15,106.94 24.15,106.94 18.09,100.88 18.09,80.53 15.68,78.12 J11.37
$1I13\$1N22: length 355.2
  Top Layer w0.4: J12.20 352.57,65.09 352.42,65.24 338.94,65.24 325.48,78.71 36.72,78.71 25.97,67.96 J11.21
$1I13\$1N23: length 392.4
  Top Layer w0.4: J11.43 14.1,81.93 14.28,82.11 14.28,102.46 22.57,110.75 336.73,110.75 343.55,103.93 343.55,86.2 350.53,79.22 352.41,79.22 352.57,79.06 J12.42
$1I13\$1N24: length 355.2
  Top Layer w0.4: J12.16 351.52,62.55 351.37,62.7 337.89,62.7 324.43,76.17 37.77,76.17 27.02,65.42 J11.17
$1I13\$1N26: length 360.5
  Top Layer w0.4: J12.22 353.99,66.66 343.94,66.66 328.39,82.21 66.69,82.21 62.42,86.48 41.85,86.48 24.9,69.53 9.52,69.53 J11.23
$1I13\$1N29: length 391.7
  Top Layer w0.4: J11.47 10.97,84.47 11.4,84.9 11.4,104 19.8,112.4 339.8,112.4 345.2,107 345.2,88 351.6,81.6 J12.46
$1I13\$1N30: length 349.7
  Top Layer w0.4: J11.07 53.22,59.07 60.21,52.08 346.87,52.08 350.99,56.2 J12.06
$1I13\$1N31: length 5.3
  Top Layer w0.4: J12.50 354.3,84.16 TP112.1
$1I13\$1N33: length 349.7
  Top Layer w0.4: J12.08 350.47,57.47 346.35,53.35 60.74,53.35 53.74,60.34 J11.09
$1I13\$1N34: length 391.5
  Top Layer w0.4: J12.48 354.22,82.8 351.4,82.8 346.4,87.8 346.4,107.2 339.9,113.7 18.9,113.7 9.21,104.02 J11.49
$1I13\$1N35: length 388.3
  Top Layer w0.4: 357.72,80.33 v3(360,80.33) ; J11.44 v3(3.2,81.93)
  Bottom Layer w0.4: v3(360,80.33) 357.33,80.33 324.43,113.23 36.82,113.23 5.52,81.93 v3(3.2,81.93)
$1I13\$1N36: length 388.3
  Top Layer w0.4: v3(359.9,77.9) 359.79,77.79 357.72,77.79 ; J11.40 v3(3.1,79.39)
  Bottom Layer w0.4: v3(3.1,79.39) 6.57,79.39 37.87,110.69 323.38,110.69 356.17,77.9 v3(359.9,77.9)
$1I13\$1N37: length 360.4
  Top Layer w0.4: J12.26 353.99,69.2 346.9,69.2 346.63,69.47 346.33,69.47 330.78,85.02 68.08,85.02 64.3,88.8 41.89,88.8 25.16,72.07 9.52,72.07 J11.27
$1I13\$1N41: length 372.8
  Top Layer w0.4: v3(359.9,66.4) 359.86,66.36 357.72,66.36 ; v3(3.2,67.9) 5.73,67.9 J11.22
  Bottom Layer w0.4: v3(3.2,67.9) 46.46,67.9 60.79,53.57 311.01,53.57 322.99,65.55 353.23,65.55 354.08,66.4 v3(359.9,66.4)
$1I13\$1N43: length 349.7
  Top Layer w0.4: J11.05 52.69,57.8 59.68,50.81 347.4,50.81 351.52,54.93 J12.04
$1I13\$1N44: length 373.1
  Top Layer w0.4: v3(3.2,55.2) 5.73,55.2 J11.02 ; 357.72,53.66 v3(360.1,53.66)
  Bottom Layer w0.4: v3(3.2,55.2) 41.2,55.2 55.53,40.87 316.27,40.87 325.5,50.1 355.78,50.1 359.34,53.66 v3(360.1,53.66)
$1I13\$1N51: length 388.1
  Top Layer w0.4: J11.26 v3(3.3,70.5) ; 357.72,68.9 v3(360,68.9)
  Bottom Layer w0.4: v3(360,68.9) 352.6,68.9 319.7,101.8 41.1,101.8 9.8,70.5 v3(3.3,70.5)
$1I13\$1N52: length 372.5
  Top Layer w0.4: v3(3.4,64.2) 5.74,64.2 J11.16 ; 357.72,62.55 359.95,62.55 v3(360,62.6)
  Bottom Layer w0.4: v3(3.4,64.2) 44.93,64.2 59.26,49.87 312.54,49.87 324.52,61.85 354.86,61.85 355.61,62.6 v3(360,62.6)
$1I13\$1N57: length 394.9
  Top Layer w0.4: J11.50 3.24,85.74 v3(3.2,85.7) ; 357.72,84.14 v3(360,84.14)
  Bottom Layer w0.4: v3(360,84.14) 360.05,84.19 360.05,88.1 328.05,120.1 34.7,120.1 4.3,89.7 4.3,86.8 v3(3.2,85.7)
$1I13\$1N58: length 372.7
  Top Layer w0.4: 357.72,58.74 359.94,58.74 v3(360,58.8) ; J11.10 v3(3.3,60.34)
  Bottom Layer w0.4: v3(3.3,60.34) 43.33,60.34 57.66,46.01 314.14,46.01 326.12,57.99 356.4,57.99 357.21,58.8 v3(360,58.8)
$1I13\$1N59: length 6.1
  Top Layer w0.4: TP111.1 9.21,51.01 J11.01
$1I13\$1N60: length 372.3
  Top Layer w0.4: 357.72,65.09 359.89,65.09 v3(359.9,65.1) ; v3(3.4,66.7) 5.78,66.7 J11.20
  Bottom Layer w0.4: v3(359.9,65.1) 354.58,65.1 353.83,64.35 323.49,64.35 311.51,52.37 60.29,52.37 45.96,66.7 v3(3.4,66.7)
$1I13\$1N61: length 372.5
  Top Layer w0.4: v3(3.3,69.3) 5.71,69.3 J11.24 ; v3(359.9,67.7) 359.83,67.63 357.72,67.63
  Bottom Layer w0.4: v3(359.9,67.7) 353.5,67.7 352.75,66.95 322.41,66.95 310.43,54.97 61.37,54.97 47.04,69.3 v3(3.3,69.3)
$1I13\$1N62: length 372.9
  Top Layer w0.4: 357.72,56.2 v3(360.1,56.2) ; J11.06 v3(3.3,57.8)
  Bottom Layer w0.4: v3(3.3,57.8) 42.28,57.8 56.61,43.47 315.19,43.47 327.17,55.45 357.51,55.45 358.26,56.2 v3(360.1,56.2)
$1I13\$1N63: length 372.7
  Top Layer w0.4: 357.72,54.93 359.87,54.93 v3(359.9,54.9) ; J11.04 5.71,56.6 v3(3.2,56.6)
  Bottom Layer w0.4: v3(3.2,56.6) 41.78,56.6 56.11,42.27 315.69,42.27 327.67,54.25 358.11,54.25 358.76,54.9 v3(359.9,54.9)
$1I13\$1N64: length 372.7
  Top Layer w0.4: v3(3.3,65.4) 5.77,65.4 J11.18 ; 357.72,63.82 v3(360,63.82)
  Bottom Layer w0.4: v3(360,63.82) 355.12,63.82 354.35,63.05 324.03,63.05 312.05,51.07 59.76,51.07 45.42,65.4 v3(3.3,65.4)
$1I13\$1N65: length 388.3
  Top Layer w0.4: J11.42 v3(3.2,80.66) ; v3(360,79.1) 359.96,79.06 357.72,79.06
  Bottom Layer w0.4: v3(3.2,80.66) 6.05,80.66 37.35,111.96 323.91,111.96 356.77,79.1 v3(360,79.1)
$1I13\$1N66: length 387.9
  Top Layer w0.4: v3(3.4,73.1) 5.73,73.1 J11.30 ; 357.72,71.44 v3(360,71.44)
  Bottom Layer w0.4: v3(3.4,73.1) 9.18,73.1 40.48,104.4 320.78,104.4 353.74,71.44 v3(360,71.44)
$1I13\$1N68: length 372.9
  Top Layer w0.4: 357.72,57.47 v3(360,57.47) ; J11.08 3.27,59.07 v3(3.2,59)
  Bottom Layer w0.4: v3(3.2,59) 42.77,59 57.1,44.67 314.7,44.67 326.68,56.65 356.95,56.65 357.77,57.47 v3(360,57.47)
$1I13\$1N69: length 392
  Top Layer w0.4: 357.72,82.87 359.93,82.87 v3(360,82.8) ; v3(3.2,84.5) 3.23,84.47 J11.48
  Bottom Layer w0.4: v3(360,82.8) 360,83 359.2,83.81 359.2,84.61 326.2,117.6 33.9,117.6 6.1,89.8 6.1,87.1 4,85 3.7,85 v3(3.2,84.5)
$1I13\$1N71: length 387.9
  Top Layer w0.4: J11.32 v3(3.3,74.31) ; 357.72,72.71 v3(359.9,72.71)
  Bottom Layer w0.4: v3(3.3,74.31) 8.68,74.31 39.98,105.61 321.28,105.61 354.18,72.71 v3(359.9,72.71)
$1I13\$1N72: length 388.2
  Top Layer w0.4: 357.72,81.6 v3(360,81.6) ; J11.46 5.59,83.4 v3(3.3,83.4)
  Bottom Layer w0.4: v3(3.3,83.4) 4.91,83.4 36.21,114.7 325.04,114.7 358.14,81.6 v3(360,81.6)
$1I13\$1N73: length 387.9
  Top Layer w0.4: 357.72,73.98 v3(359.9,73.98) ; v3(3.3,75.5) 5.71,75.5 J11.34
  Bottom Layer w0.4: v3(3.3,75.5) 8.18,75.5 39.48,106.8 321.77,106.8 354.59,73.98 v3(359.9,73.98)
$1I19\5V_SENSE: length 114
  Top Layer w0.4: v3(146.8,24.2) 146.8,15.3 v3(152.5,9.6) ; SW2.1 v3(129.1,24.2) ; v3(192.3,11.3) 194.75,11.3 J2.41
  Bottom Layer w0.4: v3(152.5,9.6) 190.6,9.6 v3(192.3,11.3) ; v3(129.1,24.2) v3(146.8,24.2)
$1I19\$1N61: length 4
  Top Layer w0.5: R114.2 127.3,9.2
$1I19\$1N77: length 4.1
  Top Layer w0.5: R3.1 79.08,15.52 79.1,15.5
$1I19\$1N81: length 3.4
  Top Layer w0.5: R2.1 30.4,19.28 30.4,15.9
$1I19\$1N108: length 162.1
  Top Layer w0.5: v2(190.1,34.3) J2.05 J2.06 ; v2(123.3,25.9) 125.6,28.2 v2(125.6,32.9) 92.2,32.9 SW2.3 ; S2.13 S2.3 ; S111.3 121.5,13.6 v2(120.3,12.4)
  Bottom Layer w0.5: S111.3 121.5,24.1 v2(123.3,25.9) ; S2.3 120.21,12.31 v2(120.3,12.4) ; v2(190.1,34.3) 188.7,32.9 179.78,32.9 178.63,34.05 177.76,34.05 176.62,32.9 v2(125.6,32.9)
$1I19\$1N109: length 4.2
  Top Layer w0.5: R115.2 127.5,4.8
$1I19\$1N17982: length 89.9
  Top Layer w0.4: J2.42 198.47,11.6 v3(203.1,11.6) ; S111.2 126.2,17.6 v3(127.8,19.2)
  Bottom Layer w0.4: v3(127.8,19.2) 201.4,19.2 203.1,17.5 v3(203.1,11.6)
$1I19\$1N26702: length 9
  Top Layer w0.5: J3.2 37.34,6.49 U301.1
$1I19\AOUT_AH: length 28.5
  Top Layer w0.4: J2.33 191.48,16.52 190.7,17.3 U23.1
$1I19\AOUT_AL: length 40.1
  Top Layer w0.4: U24.1 223.29,19.39 220.42,16.52 J2.34
$1I19\AOUT_BH: length 21.6
  Top Layer w0.4: U25.1 188.11,14.91 188.45,15.25 J2.35
$1I19\AOUT_BL: length 30.2
  Top Layer w0.4: J2.36 226.48,15.25 U26.1
$1I19\AOUT_CH: length 27.3
  Top Layer w0.4: J2.37 194.85,13.95 177.85,13.95 176.4,12.5 U27.1
$1I19\AOUT_CL: length 36
  Top Layer w0.4: U28.1 233.66,13.98 J2.38
$1I19\BUF_PWM_AH: length 25.5
  Top Layer w0.4: J2.16 215.65,27.95 U10.1
$1I19\BUF_PWM_AL: length 27.1
  Top Layer w0.4: J2.15 194.84,27.9 v3(191.8,27.9) ; v3(175.7,27.9) 175.67,27.87 U9.1
  Bottom Layer w0.4: v3(175.7,27.9) 176.2,27.9 177.2,26.9 180.9,26.9 181.9,27.9 v3(191.8,27.9)
$1I19\BUF_PWM_BH: length 26.9
  Top Layer w0.4: U6.1 222.18,26.68 J2.18
$1I19\BUF_PWM_BL: length 35.6
  Top Layer w0.4: v3(191.8,26.7) 194.86,26.7 J2.17 ; U5.1 160.67,26.11 175.11,26.11 v3(175.7,26.7)
  Bottom Layer w0.4: v3(175.7,26.7) 176.2,26.2 191.3,26.2 v3(191.8,26.7)
$1I19\BUF_PWM_CH: length 31.2
  Top Layer w0.4: J2.20 228.95,25.41 U8.1
$1I19\BUF_PWM_CL: length 30.3
  Top Layer w0.4: J2.19 167.92,25.41 U7.1
$1I19\GD_GS_OFF: length 100.7
  Top Layer w0.4: v3(200.9,17.9) 198.42,17.9 J2.32 ; S2.C 106.8,12.58 v3(106.8,14.6)
  Bottom Layer w0.4: v3(106.8,14.6) 107.2,15 120.73,15 120.78,14.95 122.23,14.95 122.28,15 124.57,15 124.6,15.03 125.4,15.03 125.63,14.79 161,14.79 161.07,14.87 190.66,14.87 190.79,15 197.5,15 200.4,17.9 v3(200.9,17.9)
$1I19\GD_GS_ON: length 93.1
  Top Layer w0.4: v3(192.6,17.8) 194.88,17.8 J2.31 ; v3(160.1,15.6) 146.9,2.4 111.36,2.4 S2.C1
  Bottom Layer w0.4: v3(160.1,15.6) 190.4,15.6 v3(192.6,17.8)
$1I19\GD_INTB_H: length 66.5
  Top Layer w0.4: v3(137.5,11.8) 136.2,11.8 135.52,11.12 135.52,9.3 ; v3(190.9,12.7) 194.88,12.7 J2.39
  Top Layer w0.5: 130.9,9.2 135.42,9.2 135.52,9.3
  Bottom Layer w0.4: v3(190.9,12.7) 190,11.8 v3(137.5,11.8)
$1I19\GD_INTB_L: length 77.6
  Top Layer w0.4: J2.40 198.32,12.7 v3(201.3,12.7) ; v3(137.5,7.3) 136,7.3 135.52,6.82 135.52,4.8
  Top Layer w0.5: 131.1,4.8 135.52,4.8
  Bottom Layer w0.4: v3(137.5,7.3) 195.9,7.3 v3(201.3,12.7)
$1I19\INTA_AH: length 16
  Top Layer w0.4: U14.1 198.4,22.96 J2.24
$1I19\INTA_AL: length 18.4
  Top Layer w0.4: U13.1 192.25,23.25 192.6,22.9 194.85,22.9 J2.23
$1I19\INTA_BH: length 26.2
  Top Layer w0.4: J2.26 198.35,21.63 U16.1
$1I19\INTA_BL: length 24.1
  Top Layer w0.4: U15.1 178.43,20.73 179.4,21.7 194.78,21.7 J2.25
$1I19\INTA_CH: length 20.9
  Top Layer w0.4: U18.1 198.35,20.36 J2.28
$1I19\INTA_CL: length 13.6
  Top Layer w0.4: U17.1 184.06,19.46 185,20.4 194.81,20.4 J2.27
$1I19\PHASE_A_HI_RANGE: length 34.5
  Top Layer w0.4: U33.1 170.31,10.17 J2.43
$1I19\PHASE_A_LO_RANGE: length 39.3
  Top Layer w0.4: U34.1 228.23,10.17 J2.44
$1I19\PHASE_B_HI_RANGE: length 22.3
  Top Layer w0.4: U35.1 180.9,8.9 J2.45
$1I19\PHASE_B_LO_RANGE: length 26.6
  Top Layer w0.4: J2.46 217.6,8.9 U36.1
$1I19\PHASE_C_HI_RANGE: length 14.2
  Top Layer w0.4: J2.47 186.93,7.63 U37.1
$1I19\PHASE_C_LO_RANGE: length 14.1
  Top Layer w0.4: U38.1 206.57,7.63 J2.48
$1I19\SPI_CLK: length 27.8
  Top Layer w0.4: v3(201.9,30.4) 201.81,30.49 J2.12 ; J5.2 v3(189.8,29.25)
  Bottom Layer w0.4: v3(189.8,29.25) 200.75,29.25 v3(201.9,30.4)
$1I19\SPI_CS: length 28.4
  Top Layer w0.4: J2.10 201.76,31.76 v3(202.2,32.2) ; J5.5 v3(192.2,33)
  Bottom Layer w0.4: v3(202.2,32.2) 201.4,33 v3(192.2,33)
$1I19\SPI_MISO: length 16.7
  Top Layer w0.4: J2.11 194.88,30.5 J5.3
$1I19\SPI_MOSI: length 16.7
  Top Layer w0.4: J5.4 194.88,31.75 J2.09
POWER_+5VD: length 87.7
  Top Layer w0.5: J4.1 88.2,17.34 v2(88.2,17.5) ; J4.1 J4.1 ; J4.1 82.21,12.21 D2.1 ; v2(118.9,11.1) 117.99,11.1 C1.1 116.8,15.34 IC1.3 114.74,17.6 v2(116.2,17.6) ; R8.2 R7.2 138.2,9.3 v2(136.8,10.7)
  Bottom Layer w0.5: v2(136.8,10.7) 136.4,11.1 v2(118.9,11.1) ; v2(116.2,17.6) 116.1,17.5 v2(88.2,17.5) SW2.2
POWER_+12V: length 178
  Top Layer w0.5: D1.1 31.66,12.61 34.45,15.4 34.45,19.1 D11.1 52.19,36.84 J2.01 J2.03
POWER_GND: length 408.6
  Top Layer w0.4: J2.14 202.72,29.22 ; 202.72,29.22 203.4,29.9 203.4,35.3 203.1,35.6 200.19,35.6 200.16,35.57 ; 202.72,29.22 202.74,29.2 v3(204.7,29.2) ; J2.13 194.86,29.2 190.9,29.2 189.7,28 J5.1 ; J2.29 J2.30 v3(204.7,19.06) ; J2.21 J2.22 v3(204.7,24.14) ; U300.1 198.31,3.01 J2.50 204.56,6.36 v3(204.7,6.5)
  Top Layer w0.5: R2.2 27.42,6.12 U800.1 ; v2(114.8,9) 116.69,9 C1.2 120.23,9.11 120.32,9.2 ; 120.32,9.2 123.72,12.6 127.8,12.6 130.9,15.7 v4(130.9,35.3) ; 120.32,9.2 120.32,4.8 120.21,4.69 S2.11 ; 28.3,6.63 28.9,6.03 33.34,6.03 35.12,4.25 39.29,4.25 41.44,6.4 J3.1 ; IC1.1 111.9,19.19 C2.2 103.99,14.08 S2.1 103.46,11.78 J4.3 J4.2 ; 76.12,19.6 76.12,5.73 U900.1 75.67,5.05 ; J4.2 90.76,2.8 76,2.8 75.65,3.15 75.65,5.03 75.67,5.05 ; J4.2 98.12,1.2 v2(114.8,1.2) ; J3.1 74.32,6.4 75.67,5.05 ; J3.1 42.34,14.51 D11.2 ; J2.49 J2.50 ; v4(201.5,39.6) 198.74,36.84 J2.02 J2.04 200.53,35.57 201.1,35 201.1,33.4 200.75,33.05 198.33,33.05 J2.08 J2.07 ; J2.13 J2.14
  Bottom Layer w0.4: v3(204.7,6.5) v3(204.7,19.06) v3(204.7,24.14) v3(204.7,29.2)
  Bottom Layer w0.5: v4(130.9,35.3) 135.2,39.6 v4(201.5,39.6) ; v2(114.8,1.2) v2(114.8,9)

## Text on the board
Top Layer: + | -
Top Silkscreen Layer: Phase_C_NTC | PhaseC_LS_G-S | Phase_C_LS_Short | Phase_C_HS_Short | 5Vdc | 5V Sense | 3-5V / 2-2.5V / 1-GND | 5V_out | Gnd_Check | Signals Check | GND_out | PhaseC_HS_G-S | Phase_B_NTC | Phase_B_LS_Short | PhaseB_LS_G-S | Phase_B_HS_Short | PhaseB_HS_G-S | Phase_A_NTC | Phase_A_LS_Short | PhaseA_LS_G-S | Phase_A_HS_Short | Signals_Check | PhaseA_HS_G-S | 12V DC Input | 5V DC Input | PL200_Signals
